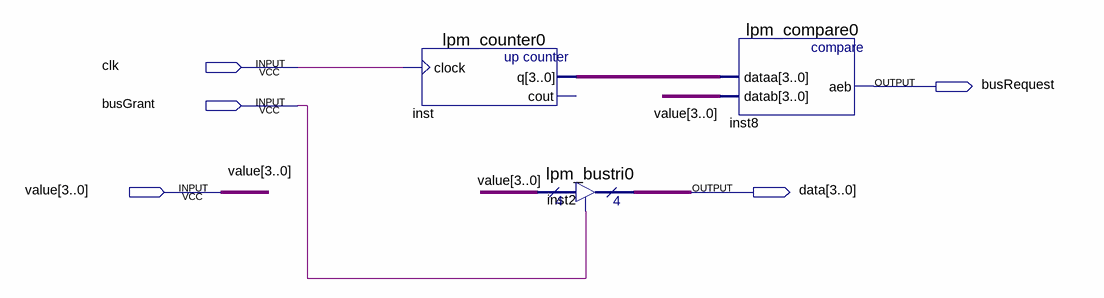
[diagram p0: schematic sheet]
// Quartus schematic Device.bdf as structural Verilog: 3 symbols, 5 pins
module Device (
  input  clk,
  input  busGrant,
  input  [3:0] value,
  output busRequest,
  output [3:0] data
);

  wire [3:0] inst_q;

  lpm_counter0 inst (.clock(clk), .q(inst_q));  // open: cout
  lpm_bustri0 inst2 (.enabledt(busGrant), .data(value), .tridata(data));
  lpm_compare0 inst8 (.dataa(inst_q), .datab(value), .aeb(busRequest));
endmodule
